# Altium schematic sheet TB-S5D5_p04_Connectors-v1.2.SchDoc: Renesas AE-CAP1-S3 Target Board
size Legal; Author: Jorge Amodio; Organization: Serious Integrated, Inc.; Address1: 145 s 79th Street; Address2: Suite 34; Address3: Chandler, AZ 85226; Address4: USA; DocumentNumber: 4; Revision: PCB02; SheetNumber: 4; SheetTotal: 5; CompanyURL: www.seriousintegrated.com; ReleaseDate: 8/12/2016; Version: v1.1; Company Name: Renesas Electronics America; PageSetup: Record=PageOptions|CenterHorizontal=True|CenterVertical=True|PrintScale=1.00|XCorrection=1.00|YCorrection=1.00|PrintKind=1|BorderSize=5000000|LeftOffset=0|BottomOffset=0|Orientation=2|PaperLength=1000|PaperWidth=1000|Scale=100|PaperSource=7|PrintQuality=-4|MediaType=1|DitherType=10|PaperKind=A5 148x210mm|PrintScaleMode=1
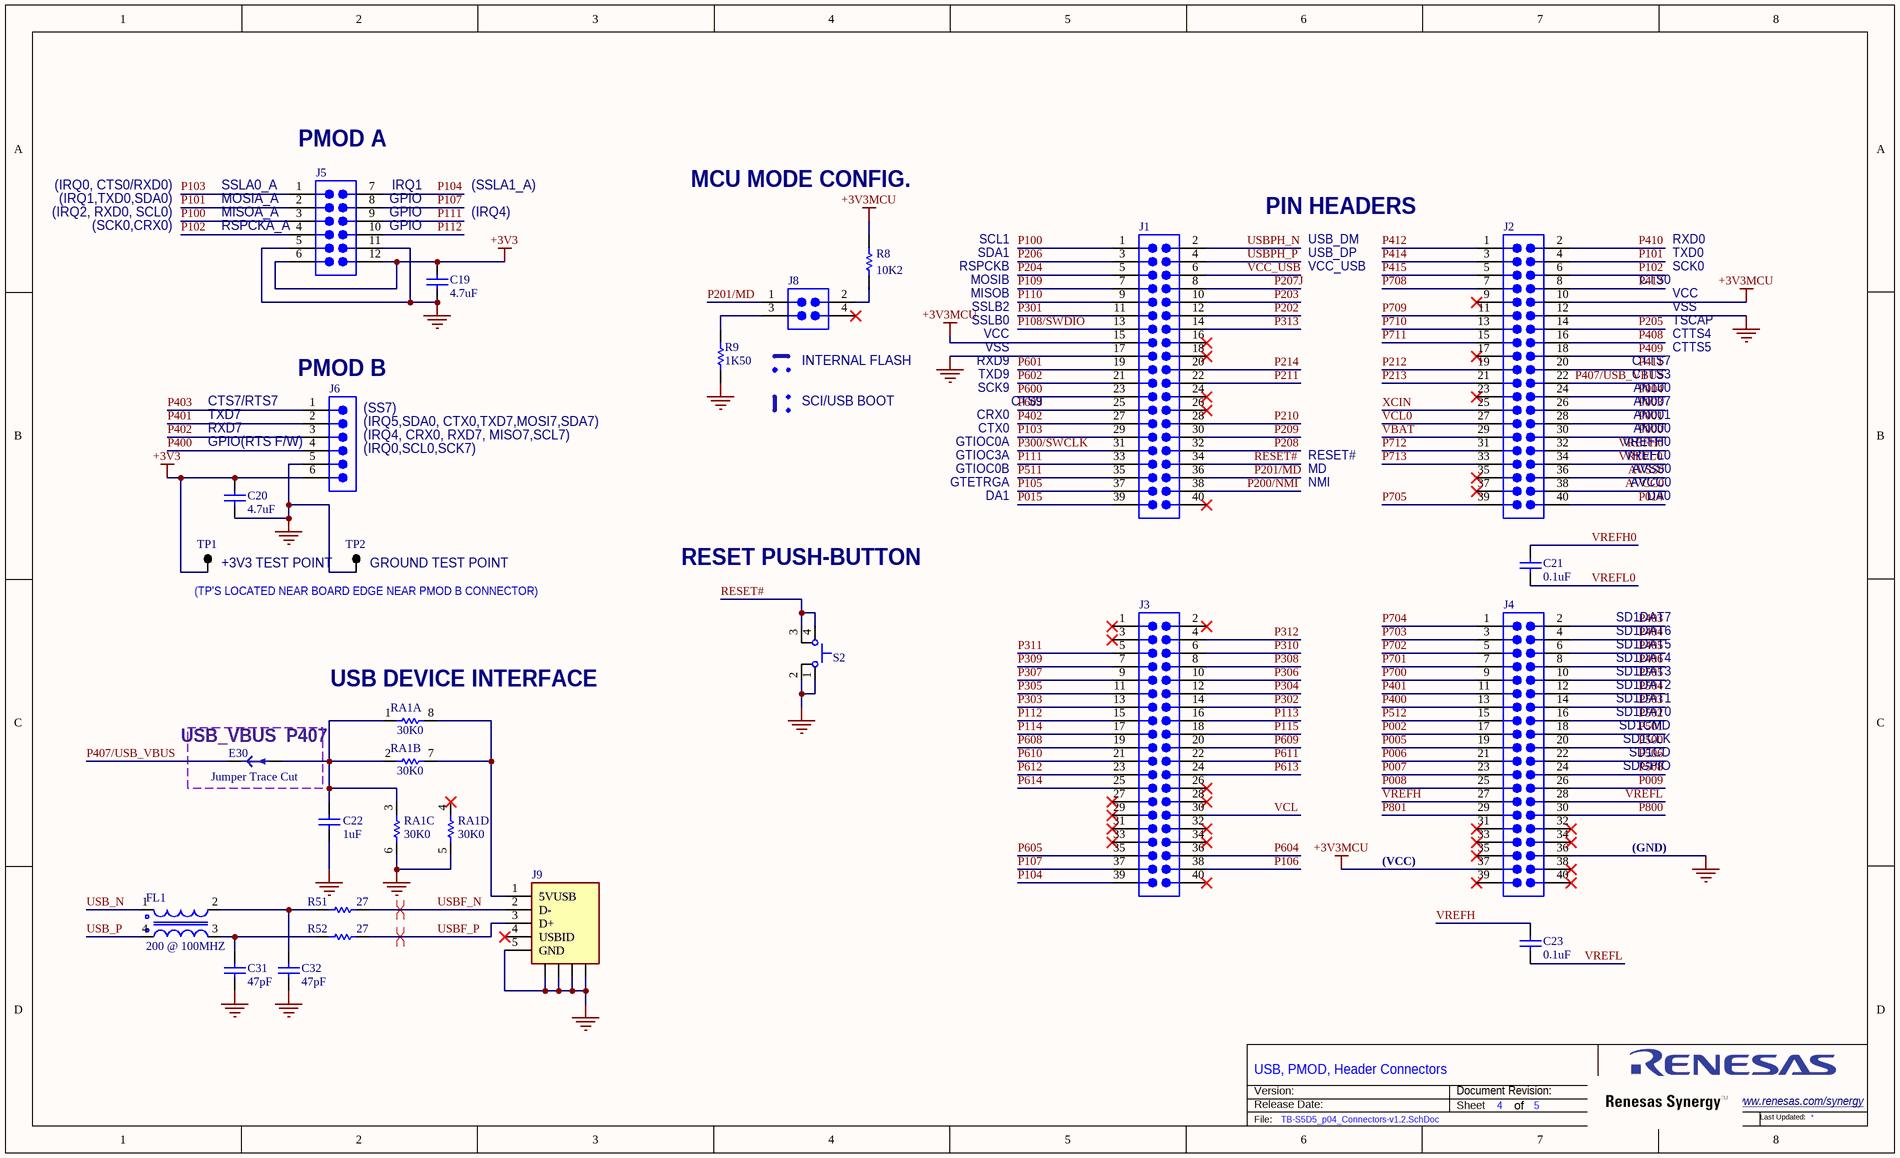
[diagram p0: TB-S5D5_p04_Connectors-v1.2.SchDoc]

## Parts
C19  Capacitance: 4.7uF  [CAPC0603-01]  (hidden comment: CAP-000043-01)
C20  Capacitance: 4.7uF  [CAPC0603-01]  (hidden comment: CAP-000043-01)
C21  Capacitance: 0.1uF  [CAPC0603-01]  (hidden comment: CAP-000029-01)
C22  Capacitance: 1uF  [CAPC0402-01]  (hidden comment: CAP-000063-01)
C23  Capacitance: 0.1uF  [CAPC0603-01]  (hidden comment: CAP-000029-01)
C31  Capacitance: 47pF  [CAPC0402-01]  (hidden comment: CAP-000127-01)
C32  Capacitance: 47pF  [CAPC0402-01]  (hidden comment: CAP-000127-01)
E30  Jumper Trace Cut  [E_PadsTraceCut0805]  (net tie, no BOM)
FL1  Resistance: 200 @ 100MHZ  [FL0504]  (hidden comment: IND-000027-01)
J1  CON-000109-A1  [J_2x20pHDR100mil]  (value not drawn)
J2  CON-000109-A1  [J_2x20pHDR100mil]  (value not drawn)
J3  CON-000109-A1  [J_2x20pHDR100mil]  (value not drawn)
J4  CON-000109-A1  [J_2x20pHDR100mil]  (value not drawn)
J5  CON-000050-01  [SAMTEC_SSW-106-02-F-D-RA-PMOD]  (value not drawn)
J6  CON-000148-01  [SAMTEC_SSW-106-02-F-S-RA]  (value not drawn)
J8  CON-000174-01  [FCI_77313-801-04LF]  (value not drawn)
J9  CON-000116-01  [FCI_10118192]  (value not drawn)
R8  Resistance: 10K2  [RESC0603-01]  (hidden comment: RES-000091-01)
R9  Resistance: 1K50  [RESC0402-01]  (hidden comment: RES-000140-01)
R51  Resistance: 27  [RESC0603-01]  (hidden comment: RES-R70620-01)
R52  Resistance: 27  [RESC0603-01]  (hidden comment: RES-R70620-01)
RA1  Resistance: 30K0  [RESCAF0804]  (hidden comment: RES-000117-01)  (parts A,B,C,D of 4)
S2  SWT-000013-01  [SW_C&K_PTS645_43]  (value not drawn)
TP1  Test Point  [TP_40milTHpad]  (value not drawn)  (no BOM)
TP2  Test Point  [TP_40milTHpad]  (value not drawn)  (no BOM)

## Blocks framed on the sheet
USB_VBUS  P407: E30

## Nets
+3V3: C19.2 C20.2 J5.6 J5.12 J6.6 TP1.1(TP)
+3V3MCU: J1.15 J2.10 J4.37 R8.2
GND: C19.1 C20.1 C22.1 C31.1 C32.1 J1.17 J2.12 J4.36 J5.5 J5.11 J6.5 J9.5(GND) J9.C1 J9.C2 J9.C3 J9.C4 R9.1 RA1.5 RA1.6 S2.1 S2.2 TP2.1(TP)
AVCC0: J2.38
AVSS0: J2.36
P000: J2.30
P001: J2.28
P002: J4.17
P003: J2.26
P004: J2.24
P005: J4.19
P006: J4.21
P007: J4.23
P008: J4.25
P009: J4.26
P014: J2.40
P015: J1.39
P100: J1.1 J5.3
P101: J2.4 J5.2
P102: J2.6 J5.4
P103: J1.29 J5.1
P104: J3.39 J5.7
P105: J1.37
P106: J3.38
P107: J3.37 J5.8
P108/SWDIO: J1.13
P109: J1.7
P110: J1.9
P111: J1.33 J5.9
P112: J3.15 J5.10
P113: J3.16
P114: J3.17
P115: J3.18
P200/NMI: J1.38
P201/MD: J1.36 J8.1
P202: J1.12
P203: J1.10
P204: J1.5
P205: J2.14
P206: J1.3
P207J: J1.8
P208: J1.32
P209: J1.30
P210: J1.28
P211: J1.22
P212: J2.19
P213: J2.21
P214: J1.20
P300/SWCLK: J1.31
P301: J1.11
P302: J3.14
P303: J3.13
P304: J3.12
P305: J3.11
P306: J3.10
P307: J3.9
P308: J3.8
P309: J3.7
P310: J3.6
P311: J3.5
P312: J3.4
P313: J1.14
P400: J4.13 J6.4
P401: J4.11 J6.2
P402: J1.27 J6.3
P403: J4.2 J6.1
P404: J4.4
P405: J4.6
P406: J4.8
P407/USB_VBUS: E30.1(A) J2.22
P408: J2.16
P409: J2.18
P410: J2.2
P411: J2.20
P412: J2.1
P413: J2.8
P414: J2.3
P415: J2.5
P500: J4.20
P501: J4.18
P502: J4.16
P503: J4.14
P504: J4.12
P505: J4.10
P506: J4.22
P508: J4.24
P511: J1.35
P512: J4.15
P600: J1.23
P601: J1.19
P602: J1.21
P603: J1.25
P604: J3.36
P605: J3.35
P608: J3.19
P609: J3.20
P610: J3.21
P611: J3.22
P612: J3.23
P613: J3.24
P614: J3.25
P700: J4.9
P701: J4.7
P702: J4.5
P703: J4.3
P704: J4.1
P705: J2.39
P708: J2.7
P709: J2.11
P710: J2.13
P711: J2.15
P712: J2.31
P713: J2.33
P800: J4.30
P801: J4.29
RESET#: J1.34 S2.3 S2.4
USB_N: FL1.1
USB_P: FL1.4
USBF_N: J9.2(D-) R51.2
USBF_P: J9.3(D+) R52.2
USBPH_N: J1.2
USBPH_P: J1.4
VBAT: J2.29
VCC_USB: J1.6
VCL: J3.30
VCL0: J2.27
VREFH: C23.2 J4.27
VREFH0: C21.2 J2.32
VREFL: C23.1 J4.28
VREFL0: C21.1 J2.34
XCIN: J2.25
NetC22_2: C22.2 E30.2(A) RA1.1 RA1.2 RA1.3
NetC31_2: C31.2 FL1.3 R52.1
NetC32_2: C32.2 FL1.2 R51.1
NetJ8_2: J8.2 R8.1
NetJ8_3: J8.3 R9.2
NetJ9_1: J9.1(5VUSB) RA1.7 RA1.8

Not connected (* = marked no-connect by the designer): J1 16* 18* 24* 26* 40*; J2 9* 17* 23* 35* 37*; J3 1* 2* 3* 26* 27* 28* 29* 31* 32* 33* 34* 40*; J4 31* 32* 33* 34* 35* 38* 39* 40*; J8 4*; J9 4(USBID)*; RA1 4*

## Layout directives
differential pair: USBF_N, USBF_P

## Notes on the sheet
- (near J5) PMOD A
- (IRQ0, CTS0/RXD0)
- (IRQ1,TXD0,SDA0)
- (IRQ2, RXD0, SCL0)
- (SCK0,CRX0)
- (near J5) SSLA0_A
- (near J5) MOSIA_A
- (near J5) MISOA_A
- (near J5) RSPCKA_A
- (near J5) IRQ1
- (near J5) GPIO
- GPIO
- (IRQ4)
- (SSLA1_A)
- MCU MODE CONFIG.
- PIN HEADERS
- SCL1
- SDA1
- RSPCKB
- MOSIB
- MISOB
- USB_DM
- USB_DP
- VCC_USB
- RXD0
- TXD0
- SCK0
- CTS0
- VCC
- (near J8) INTERNAL FLASH
- SSLB2
- SSLB0
- VSS
- RXD9
- TSCAP
- CTTS4
- CTTS5
- CTTS7
- CTS7/RTS7
- TXD7
- RXD7
- (near J6) PMOD B
- (near J6) (IRQ5,SDA0, CTX0,TXD7,MOSI7,SDA7)
- (near J6) (SS7)
- SCI/USB BOOT
- TXD9
- SCK9
- CTS9
- CRX0
- CTX0
- CTTS3
- AN100
- AN007
- AN001
- AN000
- GPIO(RTS F/W)
- (near J6) (IRQ0,SCL0,SCK7)
- (near J6) (IRQ4, CRX0, RXD7, MISO7,SCL7)
- GTIOC0A
- GTIOC3A
- GTIOC0B
- GTETRGA
- DA1
- RESET#
- MD
- NMI
- DA0
- VREFH0
- VREFL0
- AVSS0
- AVCC0
- (near TP1) +3V3 TEST POINT
- (near TP2) GROUND TEST POINT
- RESET PUSH-BUTTON
- (TP'S LOCATED NEAR BOARD EDGE NEAR PMOD B CONNECTOR)
- SD1DAT7
- SD1DAT6
- (near RA1) USB DEVICE INTERFACE
- SD1DAT5
- SD1DAT4
- SD1DAT3
- SD1DAT2
- SD1DAT1
- SD1DAT0
- SD1CMD
- SD1CLK
- SD1CD
- SDGPIO
- (VCC)
- (GND)
- USB, PMOD, Header Connectors
- Version:
- Release Date:
- Document Revision:
- Sheet
- of
- www.renesas.com/synergy <http://www.renesas.com/synergy>
- File:
- 60
- Last Updated:

## Library data of the parts
C19 C20 = CAP-000043-01: Ceramic Chip Capacitor 0603 4.7uF 6.3V; Manufacturer: Samsung; Mfg Part Number: CL10A475KQ8NNNL; Dialectric: X5R; Tolerance: 10%; Voltage: 6.3V; Package: 0603
C21 C23 = CAP-000029-01: Ceramic Chip Capacitor 0603 0.1uF 50V; Manufacturer: Samsung; Mfg Part Number: CL10B104KB8NNNC; Dialectric: X7R; Tolerance: 10%; Voltage: 50V; Package: 0603
C22 = CAP-000063-01: Ceramic Chip Capacitor 0402 1uF 16V; Manufacturer: Samsung; Mfg Part Number: CL05A105KO5NNNC; Dialectric: X5R; Tolerance: 10%; Voltage: 16V; Package: 0402
C31 C32 = CAP-000127-01: Ceramic Chip Capacitor 0402 47pF 50V NP0/C0G; Manufacturer: Murata; Mfg Part Number: GRM1555C1H470JA01D; Dialectric: NP0; Tolerance: 5%; Voltage: 50V; Package: 0402
E30 = E_JmpTraceCut: Pads on PCB with Trace Between for Cutting to isolate
FL1 = IND-000027-01: Common Mode Filter Inductor, 200 ohm CM @ 100MHz; Manufacturer: Murata; Mfg Part Number: DLP11SN201HL2L; Current: 0.110A; Tolerance: 20%; Package: FL0504
J1-J4 = CON-000109-A1: Header 0.1" pitch 40pos 2x20, T<->B Inverted; Manufacturer: Sullins; Mfg Part Number: PRPC020DAAN-RC; Positions: 40; Pitch: 2.54mm
J5 = CON-000050-01_P: Samtec Female Header 0.1" pitch PMOD 2x6 Right Angle; Mfg Part Number: SSW-106-02-F-D-RA; Positions: 12; Pitch: 2.54mm; Manufacturer: Samtec
J6 = CON-000148-01: Samtec Female Header 0.1" pitch 6pos 1x6 Right Angle; Mfg Part Number: SSW-106-02-FM-S-RA; Positions: 6; Pitch: 2.54mm; Manufacturer: Samtec
J8 = CON-000174-01: FCI Header 0.1" pitch 4pos 2x2; Mfg Part Number: 67997-404HLF; Positions: 4; Pitch: 2.54mm; Manufacturer: FCI
J9 = CON-000116-01: USB Micro 2.0 Female 5 Pin Right Angle; Manufacturer: FCI; Mfg Part Number: 10118192-0001LF
R8 = RES-000091-01: Chip Resistor Thick Film 0603 10K2 1% 1/10W; Manufacturer: NIC; Mfg Part Number: NRC06F1022TRF; Package: 0603; Power: 1/10W; Tolerance: 1%
R9 = RES-000140-01: Chip Resistor Thick Film 0402 1K50 0.5% 1/16W; Manufacturer: Panasonic; Mfg Part Number: ERA-2AED152X; Package: 0402; Power: 1/16W; Tolerance: 0.5%
R51 R52 = RES-000210-01: Chip Resistor Thick Film 0603 27 5% 1/10W; Manufacturer: Stackpole; Mfg Part Number: RMCF0603JT27R0; Package: 0603; Power: 1/10W; Tolerance: 5%
RA1 = RES-000117-01: Chip Resistor Array 0804 30K0 5% 1/16W 4 x 0402; Manufacturer: Panasonic; Mfg Part Number: EXB-28V303JX; Package: 0804; Power: 1/16W; Tolerance: 5%
S2 = SWT-000013-01: Push Button Switch 6 x 6mm 4.3mm High; Manufacturer: C&K; Mfg Part Number: PTS645SM43SMTR92 LFS; Serious P/N: SWT-000013-01
TP1 TP2 = TP_TH: Test Point, Through Hole Pad 40mil ID